# Altium schematic sheet MainBoard_V1p0_SD.SchDoc
size A4; SheetNumber: 7; SheetTotal: 8
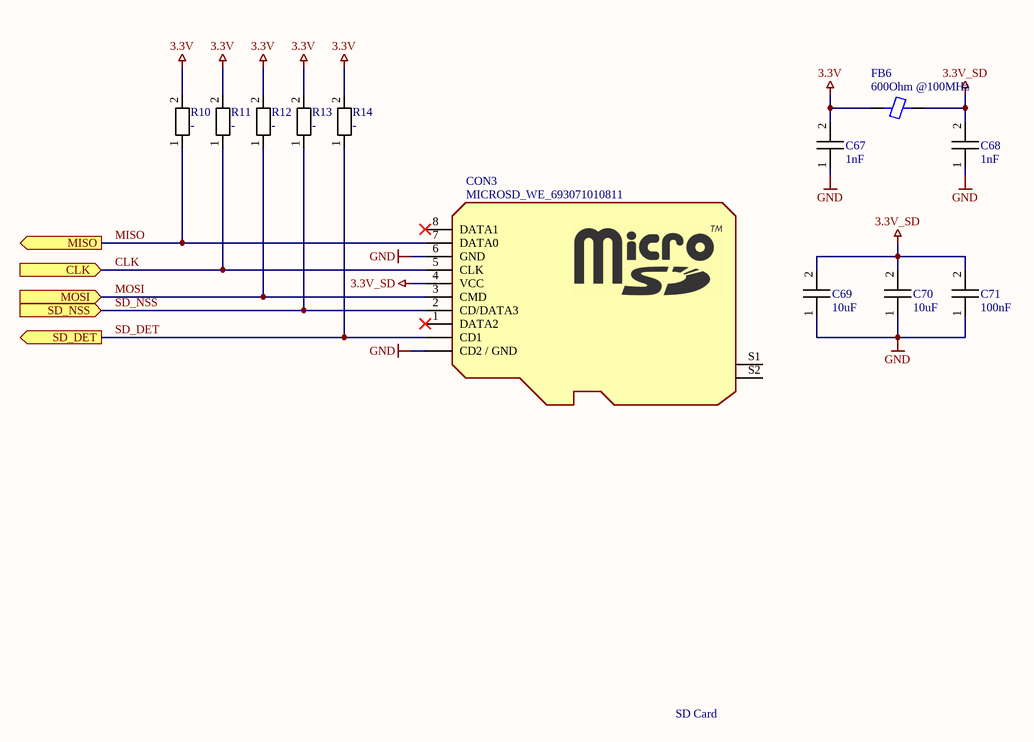
[diagram p0: MainBoard_V1p0_SD.SchDoc]

## Parts
C67  1nF  [0805_C]
C68  1nF  [0805_C]
C69  10uF  [1210_C]
C70  10uF  [1210_C]
C71  100nF  [0805_C]
CON3  MICROSD_WE_693071010811  [T_Wurth_693071010811]
FB6  600Ohm @100MHz  [0805_FB]
R10  -  [0805]
R11  -  [0805]
R12  -  [0805]
R13  -  [0805]
R14  -  [0805]

## Ports
CLK (in), MISO (out), MOSI (in), SD_DET (out), SD_NSS (in)

## Nets
3.3V: C67.2 FB6.1 R10.2 R11.2 R12.2 R13.2 R14.2
3.3V_SD: C68.2 C69.2 C70.2 C71.2 CON3.4(VCC) FB6.2
GND: C67.1 C68.1 C69.1 C70.1 C71.1 CON3.6(GND) CON3.CD2(CD2_/_GND)
CLK: CON3.5(CLK) R11.1 ; port CLK
MISO: CON3.7(DATA0) R10.1 ; port MISO
MOSI: CON3.3(CMD) R12.1 ; port MOSI
SD_DET: CON3.CD1 R14.1 ; port SD_DET
SD_NSS: CON3.2(CD/DATA3) R13.1 ; port SD_NSS

Not connected (* = marked no-connect by the designer): CON3 1(DATA2)* 8(DATA1)* S1(S) S2(S)

## Notes on the sheet
- SD Card

## Library data of the parts
C67-C71 = CAPACITOR
CON3 = MICROSD_WE_693071010811: Order Number: 2081363; Supplier: FARNELL
FB6 = FERRITE_BEAD
R10-R14 = RESISTOR: Parameter 1: 10k